# Altium project PCB_Project1.PrjPCB
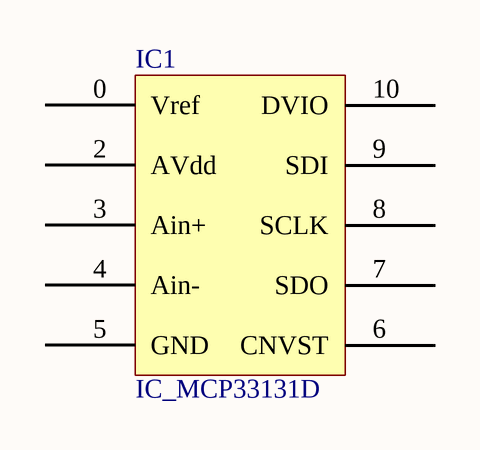
[diagram p0: Sheet1.SchDoc]
1 sheet, 1 parts. Net scope: global (net labels, ports and power ports of the same name join across sheets).
Board file: PCB1.PcbDoc

## Sheet Sheet1.SchDoc
size A4

### Parts
IC1  IC_MCP33131D  [TSSOP50P490X110-10N]

### Nets

Not connected (* = marked no-connect by the designer): IC1 0(Vref) 2(AVdd) 3(Ain+) 4(Ain-) 5(GND) 6(CNVST) 7(SDO) 8(SCLK) 9(SDI) 10(DVIO)